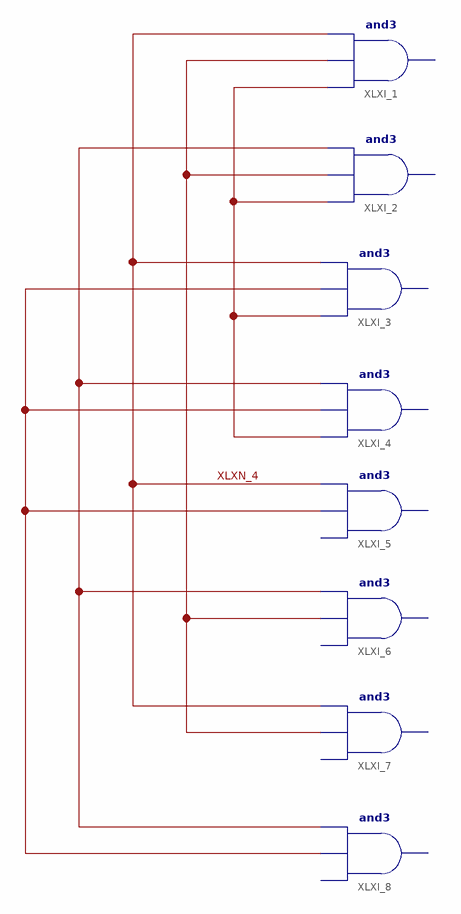
[diagram p0: schematic sheet 1]
// Xilinx ISE schematic deco.sch (spartan3e) as structural Verilog: 8 symbols, 0 ports
module deco (
);

  wire XLXN_1, XLXN_4, XLXN_5, XLXN_6, XLXN_7;

  // and3 XLXI_1 has open pins: I0=XLXN_1, I1=XLXN_7, I2=XLXN_4, O=open
  // and3 XLXI_2 has open pins: I0=XLXN_1, I1=XLXN_7, I2=XLXN_5, O=open
  // and3 XLXI_3 has open pins: I0=XLXN_1, I1=XLXN_6, I2=XLXN_4, O=open
  // and3 XLXI_4 has open pins: I0=XLXN_1, I1=XLXN_6, I2=XLXN_5, O=open
  // and3 XLXI_5 has open pins: I0=open, I1=XLXN_6, I2=XLXN_4, O=open
  // and3 XLXI_6 has open pins: I0=open, I1=XLXN_7, I2=XLXN_5, O=open
  // and3 XLXI_7 has open pins: I0=open, I1=XLXN_7, I2=XLXN_4, O=open
  // and3 XLXI_8 has open pins: I0=open, I1=XLXN_6, I2=XLXN_5, O=open
endmodule
